# EAGLE design AUDIO_dev_REV-D (EAGLE 6.5.0)
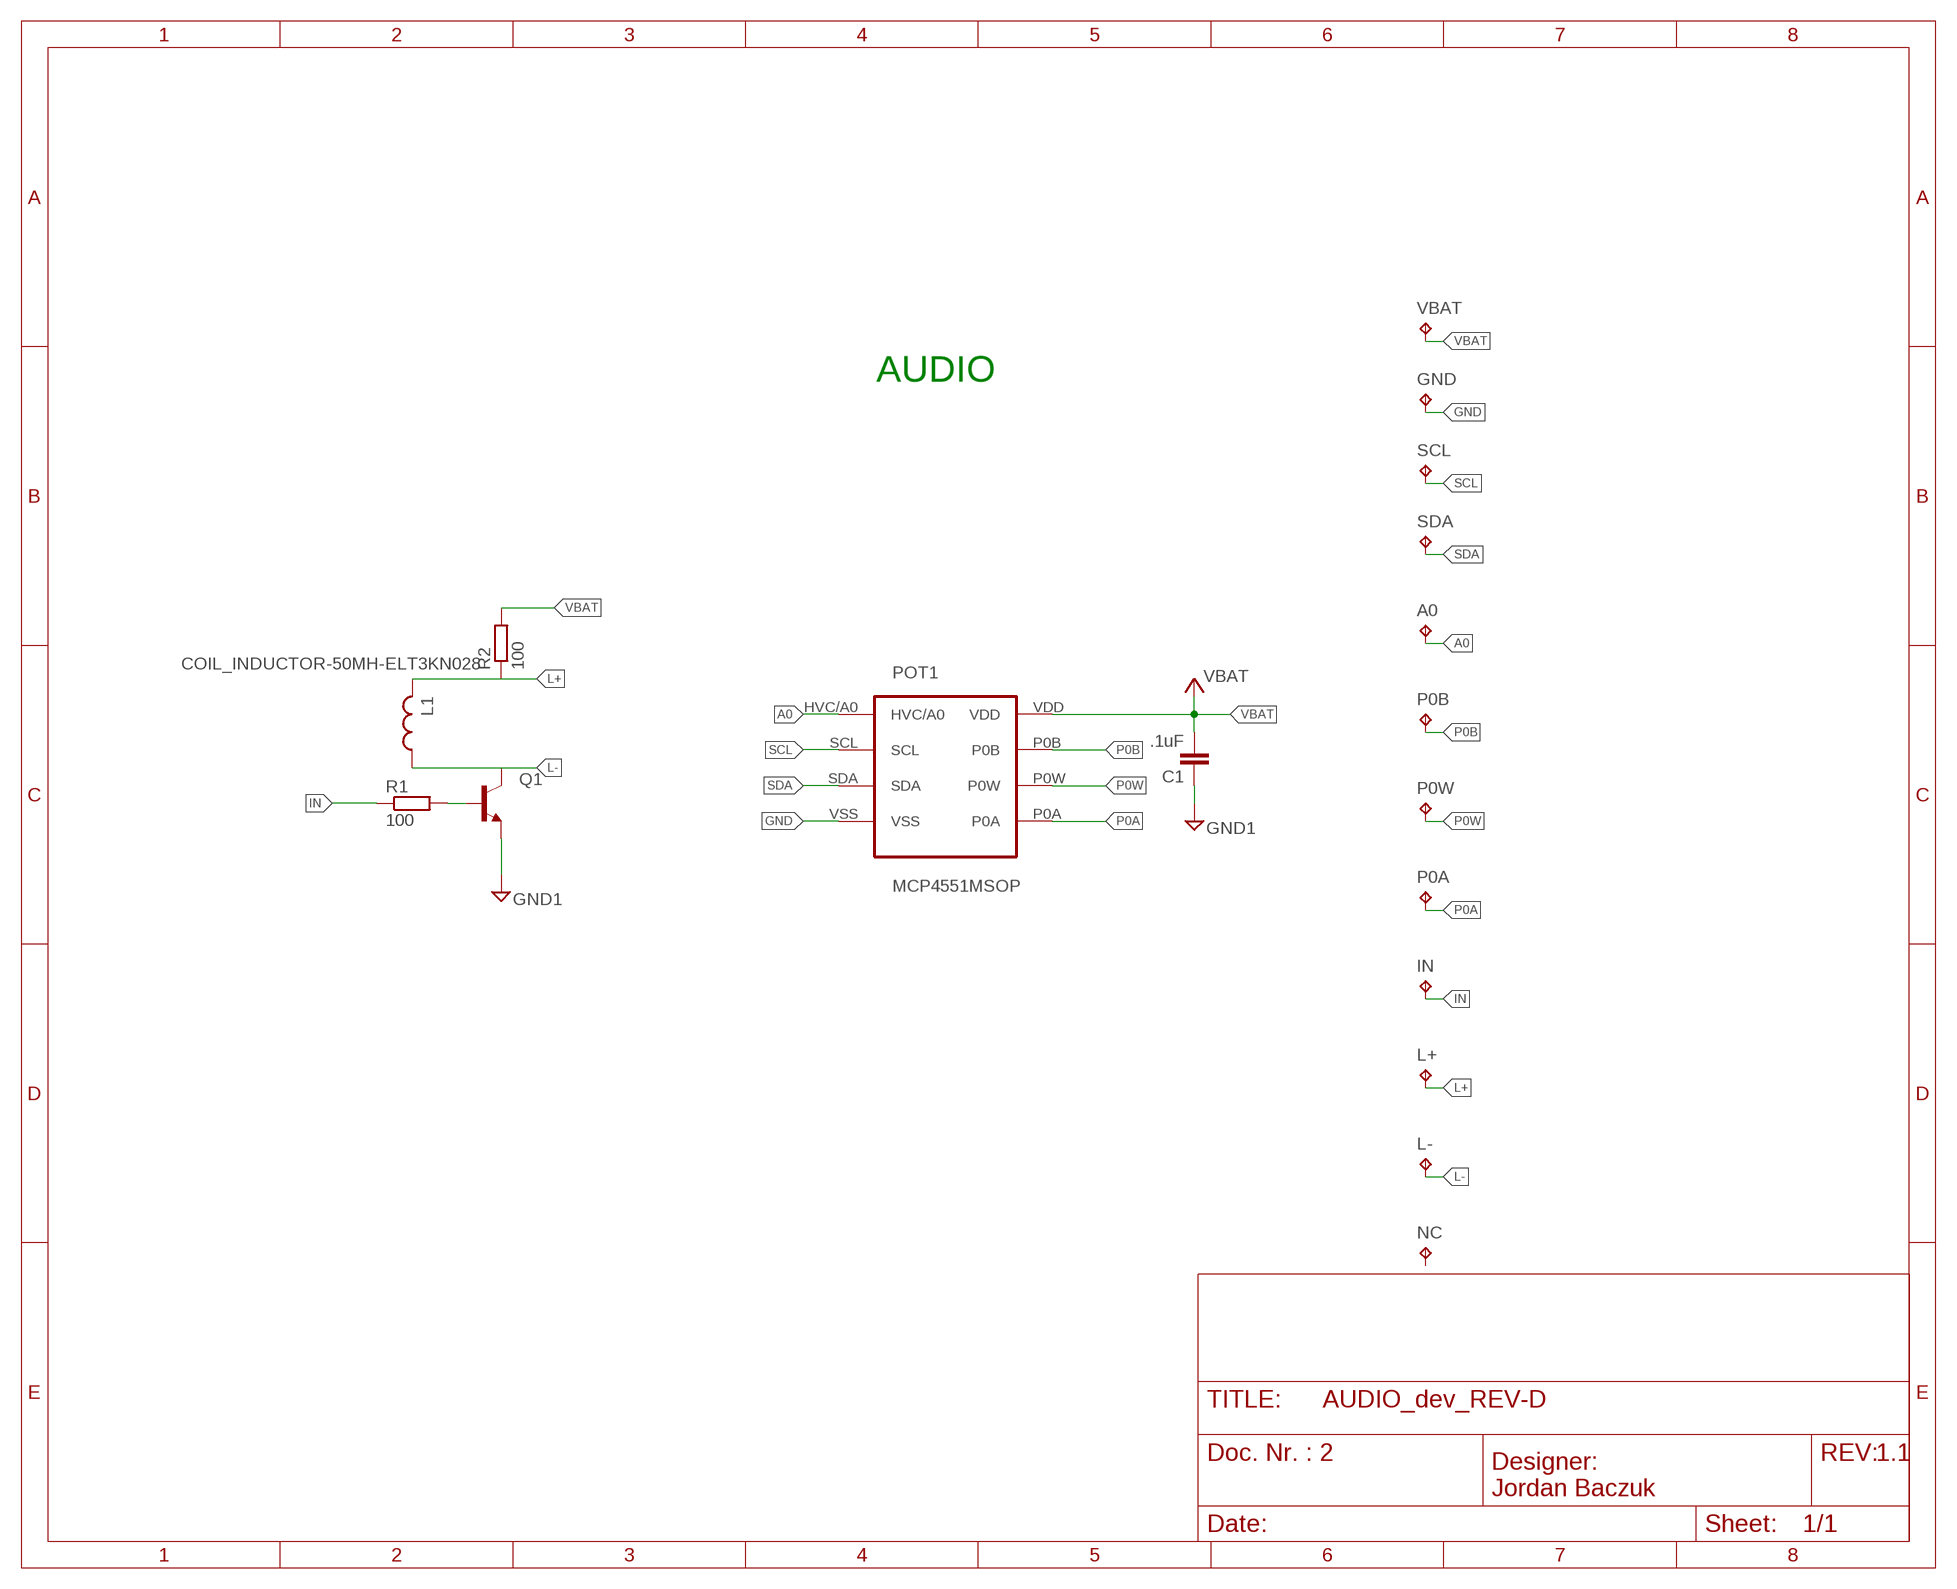
[diagram p0: schematic, sheet 1]

## Parts
A0  1X1_MALE_HEADER_0.1IN  [1X1_MALE_HEADER_0.1IN]
C1  .1uF  CHIP_CAPACITOR-.1UF-0603  [0603_PASSIVE]
GND  1X1_MALE_HEADER_0.1IN  [1X1_MALE_HEADER_0.1IN]
IN  1X1_MALE_HEADER_0.1IN  [1X1_MALE_HEADER_0.1IN]
L1  COIL_INDUCTOR-50MH-ELT3KN028  [ELT3KN028]
L+  1X1_MALE_HEADER_0.1IN  [1X1_MALE_HEADER_0.1IN]
L-  1X1_MALE_HEADER_0.1IN  [1X1_MALE_HEADER_0.1IN]
NC  1X1_MALE_HEADER_0.1IN  [1X1_MALE_HEADER_0.1IN]
P0A  1X1_MALE_HEADER_0.1IN  [1X1_MALE_HEADER_0.1IN]
P0B  1X1_MALE_HEADER_0.1IN  [1X1_MALE_HEADER_0.1IN]
P0W  1X1_MALE_HEADER_0.1IN  [1X1_MALE_HEADER_0.1IN]
POT1  MCP4551MSOP  [MCP4551-MSOP]
Q1  NPN_SINGLE-BC846,215-SOT23-3  [SOT23-3]
R1  100  CHIP_RESISTOR-100_OHM-0603  [0603_PASSIVE]
R2  100  CHIP_RESISTOR-100_OHM-0603  [0603_PASSIVE]
SCL  1X1_MALE_HEADER_0.1IN  [1X1_MALE_HEADER_0.1IN]
SDA  1X1_MALE_HEADER_0.1IN  [1X1_MALE_HEADER_0.1IN]
VBAT  1X1_MALE_HEADER_0.1IN  [1X1_MALE_HEADER_0.1IN]

## Nets
A0: A0.P$8(TP) POT1.HVC/A0
GND: C1.1 GND.P$8(TP) POT1.VSS Q1.E ; supply symbol labelled GND1
IN: IN.P$8(TP) R1.1
L+: L1.P$2 L+.P$8(TP) R2.1
L-: L1.P$1 L-.P$8(TP) Q1.C
N$2: Q1.B R1.2
P0A: P0A.P$8(TP) POT1.P0A
P0B: P0B.P$8(TP) POT1.P0B
P0W: P0W.P$8(TP) POT1.P0W
SCL: POT1.SCL SCL.P$8(TP)
SDA: POT1.SDA SDA.P$8(TP)
VBAT: C1.2 POT1.VDD R2.2 VBAT.P$8(TP)
Unconnected: NC.P$8(TP)

## Notes on the sheet
- AUDIO

## Library data of the parts
A0 GND IN L+ L- NC P0A P0B P0W SCL SDA VBAT = KIBAND_SCH_V3:1X1_MALE_HEADER_0.1IN
C1 = KIBAND_SCH_V3:CHIP_CAPACITOR-*-?; MANUF: MURATA; MANUF_PN: GRM1885C1H101JA01D; SUPPLIER: DIGIKEY; SUPPLIER_PN: 490-1427-1-ND
L1 = KIBAND_SCH_V3:COIL_INDUCTOR-*-?; MANUF: PANASONIC; MANUF_PN: ELT-3KN028C; SUPPLIER: MOUSER; SUPPLIER_PN: 667-ELT-3KN028C
POT1 = KIBAND_SCH_V3:MCP4551
Q1 = KIBAND_SCH_V3:NPN_SINGLE-*-?; MANUF: NXP; MANUF_PN: BC846,215; SUPPLIER: DIGIKEY; SUPPLIER_PN: 568-6064-1-ND
R1 R2 = KIBAND_SCH_V3:CHIP_RESISTOR-*-?; MANUF: PANASONIC; MANUF_PN: ERJ-3GEYJ104V; SUPPLIER: DIGIKEY; SUPPLIER_PN: P100KGCT-ND

## Board
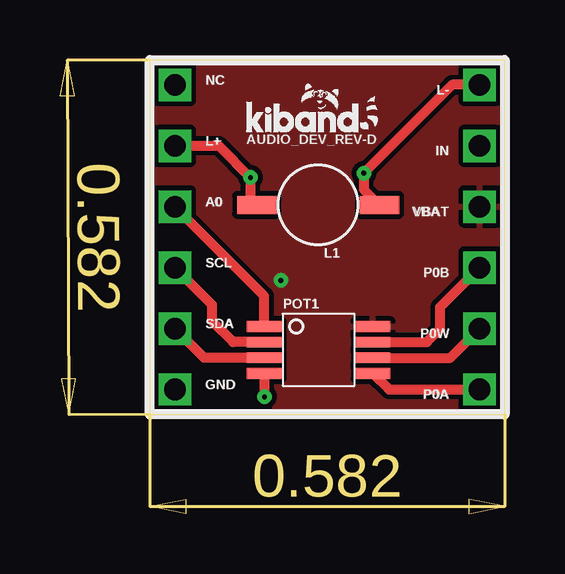
[diagram p1: board, top side]
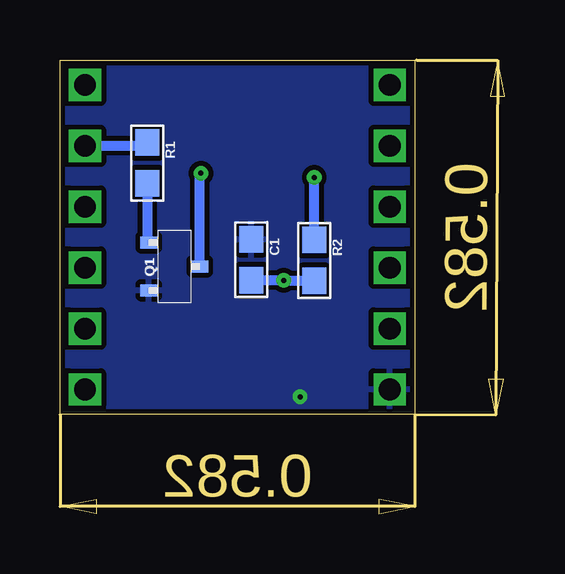
[diagram p2: board, bottom side, seen from below]

Size 14.78 x 14.78 mm. Coordinates in mm from the lower left corner, seen from the top.
Outline: 0,0 14.78,0 14.78,14.78 0,14.78 0,0
Copper layers (1*16): Top 0.035mm / dielectric 0.75mm / Bottom 0.035mm
Design rules "KiBand_8mil": minimum track width 8mil, minimum drill 8mil, track to track 8mil, track to pad 8mil, pad to pad 8mil, via to via 8mil, smd to smd 0mil, copper to edge 8mil, drill to drill 8mil, minimum pad ring 8mil, minimum via ring 8mil, stop-mask expansion 2.5mil, vias tented up to drill 6mil, thermal gap 8mil

### Footprints (pad centres in the part's own frame; a part is rotated, then mirrored left to right if it is on the bottom)
1X1_MALE_HEADER_0.1IN = drill 0.9 square: P$8 0,0
0603_PASSIVE = smd 1.1 x 1: 1 -0.85,0; 2 0.85,0
ELT3KN028 = smd 1.65 x 0.75: P$1 -2.55,0; P$2 2.55,0
MCP4551-MSOP = smd 1.45 x 0.45: HVC/A0 -2.27,0.97; P0A 2.26,-0.98; P0B 2.26,0.32; P0W 2.26,-0.33; SCL -2.27,0.32; SDA -2.27,-0.33; VDD 2.26,0.97; VSS -2.27,-0.98
SOT23-3 = smd 0.5 x 0.7: B -1,-1.125; C 0,1; E 1,-1.125

### Placement (x,y rotation side)
A0  1.04,8.66 0 top
C1  6.81,6.45 270 bottom
GND  1.04,1.04 0 top
IN  13.74,11.2 180 top
L1  7.01,8.74 180 top
L+  1.04,11.2 0 top
L-  13.74,13.74 180 top
NC  1.04,13.74 0 top
P0A  13.74,1.04 180 top
P0B  13.74,6.12 180 top
P0W  13.74,3.58 180 top
POT1  7.04,2.69 0 top
Q1  9.96,6.17 270 bottom
R1  11.15,10.49 270 bottom
R2  4.19,6.43 270 bottom
SCL  1.04,6.12 0 top
SDA  1.04,3.58 0 top
VBAT  13.74,8.66 180 top

### Tracks (layer width: path | path; a pad name or v marks a point on that pad's centre or on a via)
A0
  Top 0.406: POT1.HVC/A0 4.77,4.94 A0.P$8
GND  (via drill 0.2)
  Top 0.406: POT1.VSS 4.77,0.78 v4.78,0.74
  pour Bottom: 0,0 0,14.78 14.78,14.78 14.78,0
IN
  Bottom 0.406: IN.P$8 11.29,11.2 R1.1
L+  (via drill 0.2)
  Top 0.406: L1.P$2 4.19,9.01 v4.19,9.88 2.87,11.2 L+.P$8
  Bottom 0.406: R2.1 v4.19,9.88
L-  (via drill 0.2)
  Top 0.406: L1.P$1 8.91,9.38 v8.91,10.06 12.6,13.74 L-.P$8
  Bottom 0.406: Q1.C 8.96,10.02 v8.91,10.06
N$2
  Bottom 0.406: R1.2 11.15,7.24 Q1.B
P0A
  Top 0.406: POT1.P0A 9.97,1.04 P0A.P$8
P0B
  Top 0.406: POT1.P0B 11.55,3.01 12.09,3.56 12.09,4.47 P0B.P$8
P0W
  Top 0.406: POT1.P0W 12.52,2.36 P0W.P$8
SCL
  Top 0.406: POT1.SCL 3.46,3.01 2.59,3.89 2.59,4.57 SCL.P$8
SDA
  Top 0.406: POT1.SDA 2.26,2.36 SDA.P$8
VBAT  (via drill 0.2)
  Bottom 0.406: C1.2 5.47,5.6 v5.46,5.59 4.2,5.59 R2.2
  pour Top: 0,0 0,14.78 14.78,14.78 14.78,0

### Text on the board
_tsilk: AUDIO_DEV_REV-D